# Altium schematic sheet S7CAS-PLEIADES-CARTE-MERE_P07_POWER.SchDoc
size Tabloid; DocumentNumber: 2; SheetNumber: 2; SheetTotal: 15; Sheet_Name: POWER; Size: 11x17
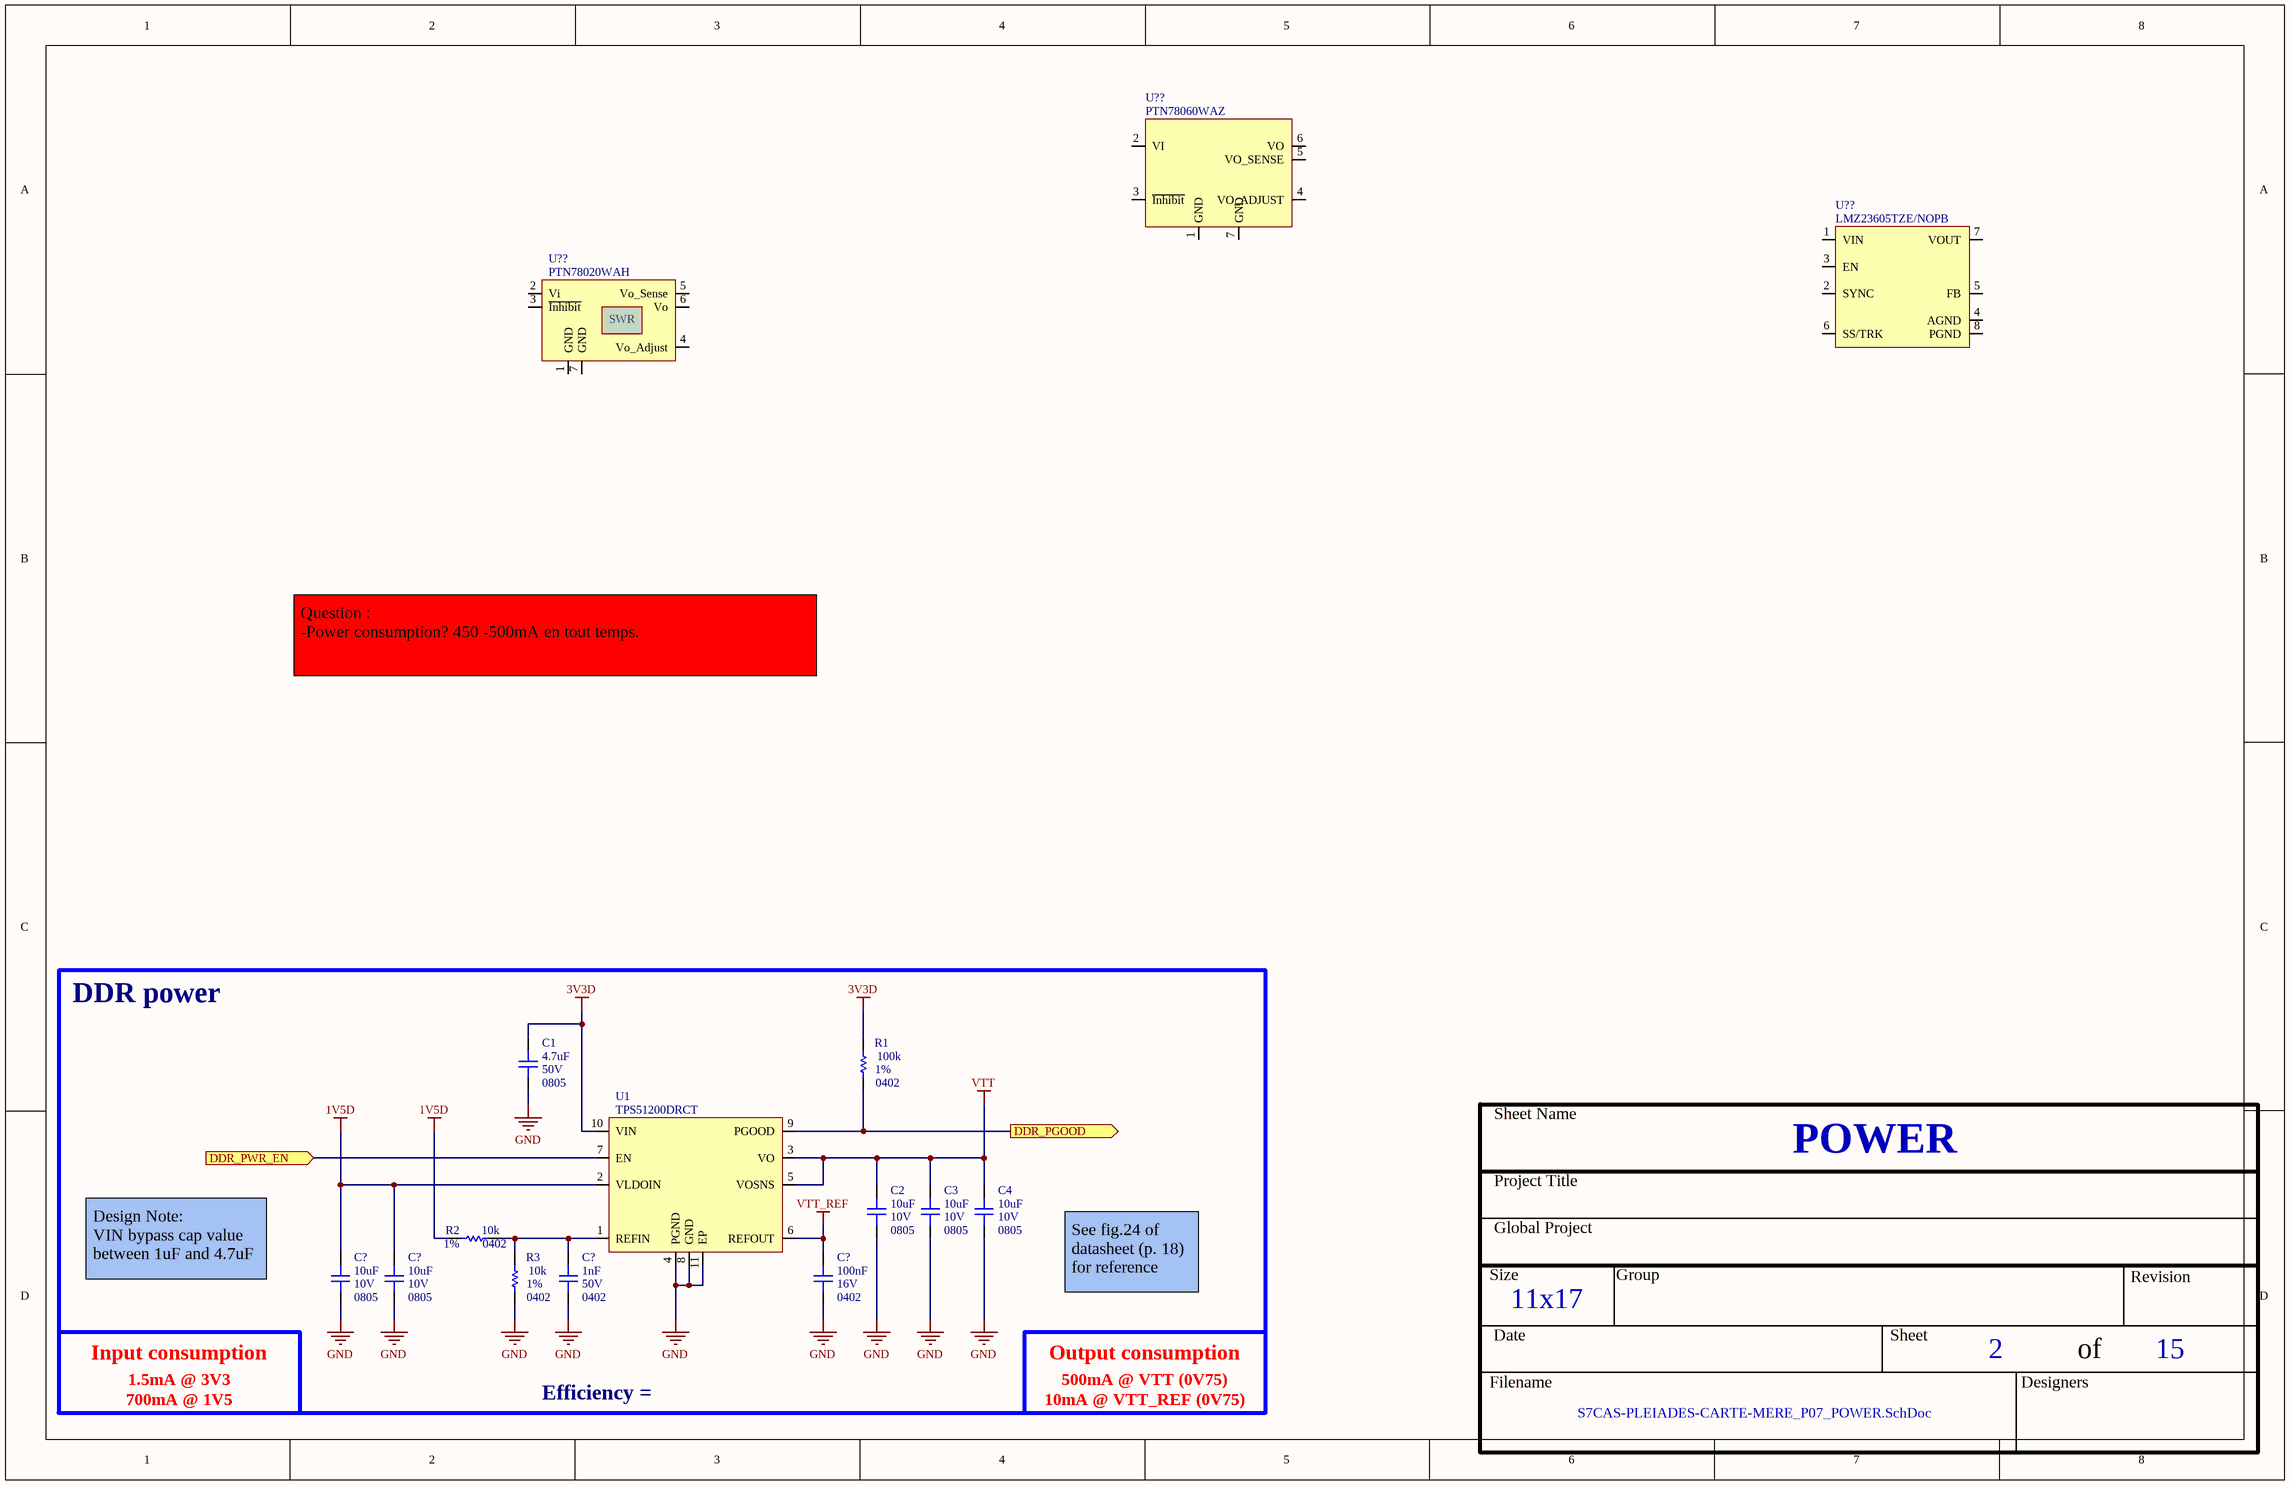
[diagram p0: S7CAS-PLEIADES-CARTE-MERE_P07_POWER.SchDoc]

## Parts
(Parts that share a designator on the sheet are numbered #1, #2 ... from top to bottom, then left to right.)
C1  value 4.7uF  Voltage: 50V  Package: 0805  [CAP_0805]  (hidden comment: CAP - 0805)
C2  value 10uF  Voltage: 10V  Package: 0805  [CAP_0805]  (hidden comment: CAP - 0805)
C3  value 10uF  Voltage: 10V  Package: 0805  [CAP_0805]  (hidden comment: CAP - 0805)
C4  value 10uF  Voltage: 10V  Package: 0805  [CAP_0805]  (hidden comment: CAP - 0805)
C?#1  value 10uF  Voltage: 10V  Package: 0805  [CAP_0805]  (hidden comment: CAP - 0805)
C?#2  value 10uF  Voltage: 10V  Package: 0805  [CAP_0805]  (hidden comment: CAP - 0805)
C?#3  value 1nF  Voltage: 50V  Package: 0402  [CAP_0402]  (hidden comment: CAP - 0402)
C?#4  value 100nF  Voltage: 16V  Package: 0402  [CAP_0402]  (hidden comment: CAP - 0402)
R1  value 100k  Package: 0402  Precision: 1%  [RES_0402]  (hidden comment: RES - 0402)
R2  value 10k  Package: 0402  Precision: 1%  [RES_0402]  (hidden comment: RES - 0402)
R3  value 10k  Package: 0402  Precision: 1%  [RES_0402]  (hidden comment: RES - 0402)
U1  TPS51200DRCT  [REG_PMIC_TPS51200DRCT]
U??#1  PTN78060WAZ  [REG_SWR_PTN78060WAZ]
U??#2  LMZ23605TZE/NOPB  [REG_SWR_LMZ23605TZE/NOPB]
U??#3  PTN78020WAH  [REG_SWR_PTN78020WAH]

## Blocks framed on the sheet
DDR power: C1-C4 C?#1-C?#4 R1-R3 U1

## Ports
DDR_PGOOD (out), DDR_PWR_EN (in)

## Nets
1V5D: C?#1.2 C?#2.2 R2.2 U1.2(VLDOIN)
3V3D: C1.2 R1.2 U1.10(VIN)
GND: C1.1 C2.1 C3.1 C4.1 C?#1.1 C?#2.1 C?#3.1 C?#4.1 R3.1 U1.4(PGND) U1.8(GND) U1.11(EP)
VTT: C2.2 C3.2 C4.2 U1.3(VO) U1.5(VOSNS)
VTT_REF: C?#4.2 U1.6(REFOUT)
DDR_PGOOD: R1.1 U1.9(PGOOD) ; port DDR_PGOOD
DDR_PWR_EN: U1.7(EN) ; port DDR_PWR_EN
NetC?#3_2: C?#3.2 R2.1 R3.2 U1.1(REFIN)

Not connected (* = marked no-connect by the designer): U??#1 1(GND) 2(VI) 3(~{Inhibit}) 4(VO_ADJUST) 5(VO_SENSE) 6(VO) 7(GND); U??#2 1(VIN) 2(SYNC) 3(EN) 4(AGND) 5(FB) 6(SS/TRK) 7(VOUT) 8(PGND); U??#3 1(GND) 2(Vi) 3(~{Inhibit}) 4(Vo_Adjust) 5(Vo_Sense) 6(Vo) 7(GND)

## Notes on the sheet
- Question :
  -Power consumption? 450 -500mA en tout temps.
- Design Note:
  VIN bypass cap value between 1uF and 4.7uF
- See fig.24 of datasheet (p. 18) for reference
- 1.5mA @ 3V3
- Input consumption
- 500mA @ VTT (0V75)
- Output consumption
- 700mA @ 1V5
- Efficiency =
- 10mA @ VTT_REF (0V75)
- Sheet Name
- Project Title
- Global Project
- Size
- Group
- Revision
- Date
- Sheet
- of
- Filename
- Designers
- (in symbol REG_SWR_PTN78020WAH) SWR

## Library data of the parts
C1 = CAP - 0805: Precision: 10%; Current: *; CreatedBy: Jonathan Bouchard; Power: *
C2-C4 C?#1 C?#2 = CAP - 0805: Mfg: CL21B106KPQNNNE; Precision: 10%; Current: *; CreatedBy: Jonathan Bouchard; Power: *
C?#3 = CAP - 0402: Mfg: C1005X7R1H102K050BA; Precision: 10%; Current: *; CreatedBy: Jonathan Bouchard; Power: *
C?#4 = CAP - 0402: Mfg Part Number: CL05B104KO5NNNC; Precision: 10%; Current: *; CreatedBy: Jonathan Bouchard; Power: *
R1-R3 = RES - 0402: Voltage: 50V; Power: 1/16W; Current: *; CreatedBy: Jonathan Bouchard
U1 = REG_PMIC_TPS51200DRCT: REG - DDR TERMINATION/REF REG - 10-VFDFN; Manufacturer #1: Texas Instruments; Value: DDR, DDR2, DDR3(L), DDR4; Voltage Rating: 2.375V ~ 3.5V; Current Rating: Source: 3A~4.5A, Sink: 3.5A~5.5A; GRAMS Lib Spec: 2.8; Magnetic Material: Unknown; Polarized: Yes; Tolerance: *; Power Max: *; HelpURL: http://www.ti.com/lit/ds/symlink/tps51200.pdf; CreatedBy/Date: Joel Lemay 2019-03-19; VerifiedBy: Nicolas V. (2019-05-31); Temperature: -40°C ~ 85°C; Package: 10-VFDFN; Manufacturer #2: *; Note: *; Assembly Type: SMD; Part Number #2: *; Part Number #1: TPS51200DRCT; Supplier 1: Digi-Key; Supplier Part Number 1: 296-23830-1-ND; Cryo: UNKNOWN
U??#1 = REG_SWR_PTN78060WAZ: REG - DC-DC Module 2.5V~12.6V ADJ OUT 3A  - 7-SMD; Manufacturer #1: Texas Instruments; Value: 2.5~12.6V (OUT); Tolerance: 3%; Voltage Rating: 7~36V (IN); GRAMS Lib Spec: 2.8; Magnetic Material: Unknown; Polarized: Yes; Current Rating: 3A; Power Max: -; HelpURL: http://www.ti.com/lit/ds/symlink/ptn78060w.pdf; CreatedBy/Date: Danae D-F 28 juin 2019; VerifiedBy: Nicolas V. (2019-07-15); Temperature: -40°C ~ 85°C; Package: 7-SMD; Manufacturer #2: -; Assembly Type: SMD; Part Number #2: -; Part Number #1: PTN78060WAZ; Supplier 1: Digi-Key; Supplier Part Number 1: 296-20525-ND; Cryo: UNKNOWN
U??#2 = REG_SWR_LMZ23605TZE/NOPB: REG - IC BUCK SYNC 36V 5A - TO-PMOD-7; Manufacturer #1: Texas Instruments; Value: 0.8 ~ 6 V; Voltage Rating: 6 ~ 36 V; GRAMS Lib Spec: 2.8; Note: One Reflow; Magnetic Material: YES; Cryo: UNKNOWN; Tolerance: *; Current Rating: 5A; Power Max: *; HelpURL: http://www.ti.com/lit/ds/symlink/lmz23605.pdf; CreatedBy/Date: Arnaud Samson - 05/07/18; VerifiedBy: Jonathan Bouchard 2018-07-13; Temperature: -40°C ~ 125°C; Package: TO-PMOD-7; Manufacturer #2: *; Assembly Type: SMD; Part Number #2: *; Part Number #1: LMZ23605TZE/NOPB; Polarized: YES; Supplier 1: Digi-Key; Supplier Part Number 1: 296-35357-1-ND
U??#3 = REG_SWR_PTN78020WAH: REG - DC DC CONVERTER 2.5-12.6V 6A - TH; Manufacturer #1: Texas Instruments; Value: 7V ~ 36V -> 2.5 ~ 12.6V; Voltage Rating: 36V; Power Max: 90 W; GRAMS Lib Spec: 2.8; Magnetic Material: Yes; Cryo: UNKNOWN; Tolerance: -; Current Rating: 6A; HelpURL: http://www.ti.com/lit/ds/symlink/ptn78020h.pdf; CreatedBy/Date: Arnaud_Samson_2019-07-09; VerifiedBy: c.Paulin - 15 juillet 2019; Temperature: -40°C ~ 85°C; Package: TH; Manufacturer #2: -; Assembly Type: TH; Part Number #2: -; Part Number #1: PTN78020WAH; Polarized: Yes; Supplier 1: Digi-Key; Supplier Part Number 1: 296-20515-ND